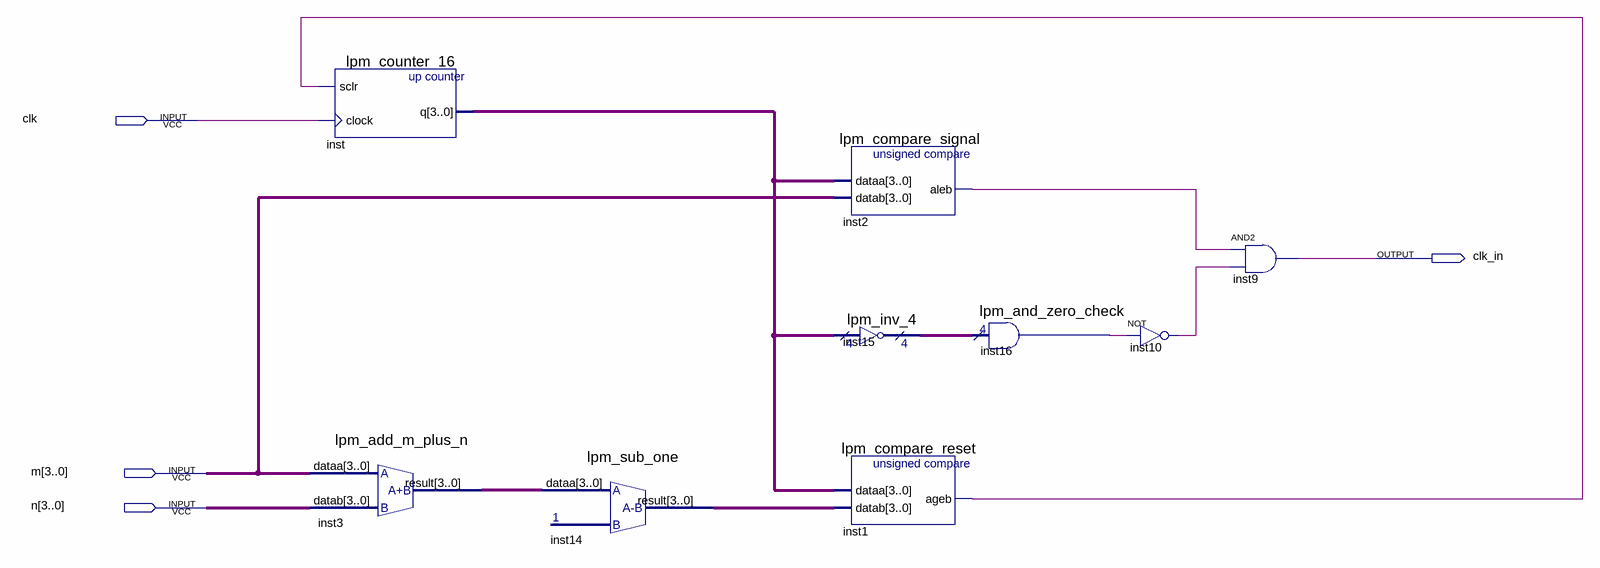
[diagram p0: schematic sheet]
// Quartus schematic Block1.bdf as structural Verilog: 9 symbols, 4 pins
module Block1 (
  input  clk,
  input  [3:0] m,
  input  [3:0] n,
  output clk_in
);

  wire inst1_ageb, inst2_aleb, inst10_out, inst16_result;
  wire [3:0] inst3_result, inst14_result, inst15_result, inst_q;

  lpm_add_m_plus_n inst3 (.dataa(m), .datab(n), .result(inst3_result));
  lpm_counter_16 inst (.sclr(inst1_ageb), .clock(clk), .q(inst_q));
  lpm_sub_one inst14 (.dataa(inst3_result), .result(inst14_result));
  lpm_compare_signal inst2 (.dataa(inst_q), .datab(m), .aleb(inst2_aleb));
  lpm_inv_4 inst15 (.data(inst_q), .result(inst15_result));
  lpm_compare_reset inst1 (.dataa(inst_q), .datab(inst14_result), .ageb(inst1_ageb));
  lpm_and_zero_check inst16 (.data(inst15_result), .result(inst16_result));
  not inst10 (inst10_out, inst16_result);
  and inst9 (clk_in, inst2_aleb, inst10_out);
endmodule
